# Altium schematic sheet Shuttler_AMC.SchDoc: =ProjectName
size 420 x 297 mm; Author: T.P.; CompanyName: WUT; DrawnBy: T.P.; Organization: WUT ISE; Address1: Warsaw Univeristy of Technology; Address2: Nowowiejska 15/19; DocumentNumber: 1; Revision: 0.9; SheetNumber: 1; SheetTotal: 36; EDA_Number: ARTIQ; Projet: ARTIQ/SINARA; ModifiedBy: -; CreateDate: XX/XX/XXXX; CheckedDate: -; Title2: Shuttler_AMC.SchDoc; DivGrp: ISE; Designer: G.K. and T.P.; ModifiedDate: -; ProjectName: ADC/DAC MEZZANINE
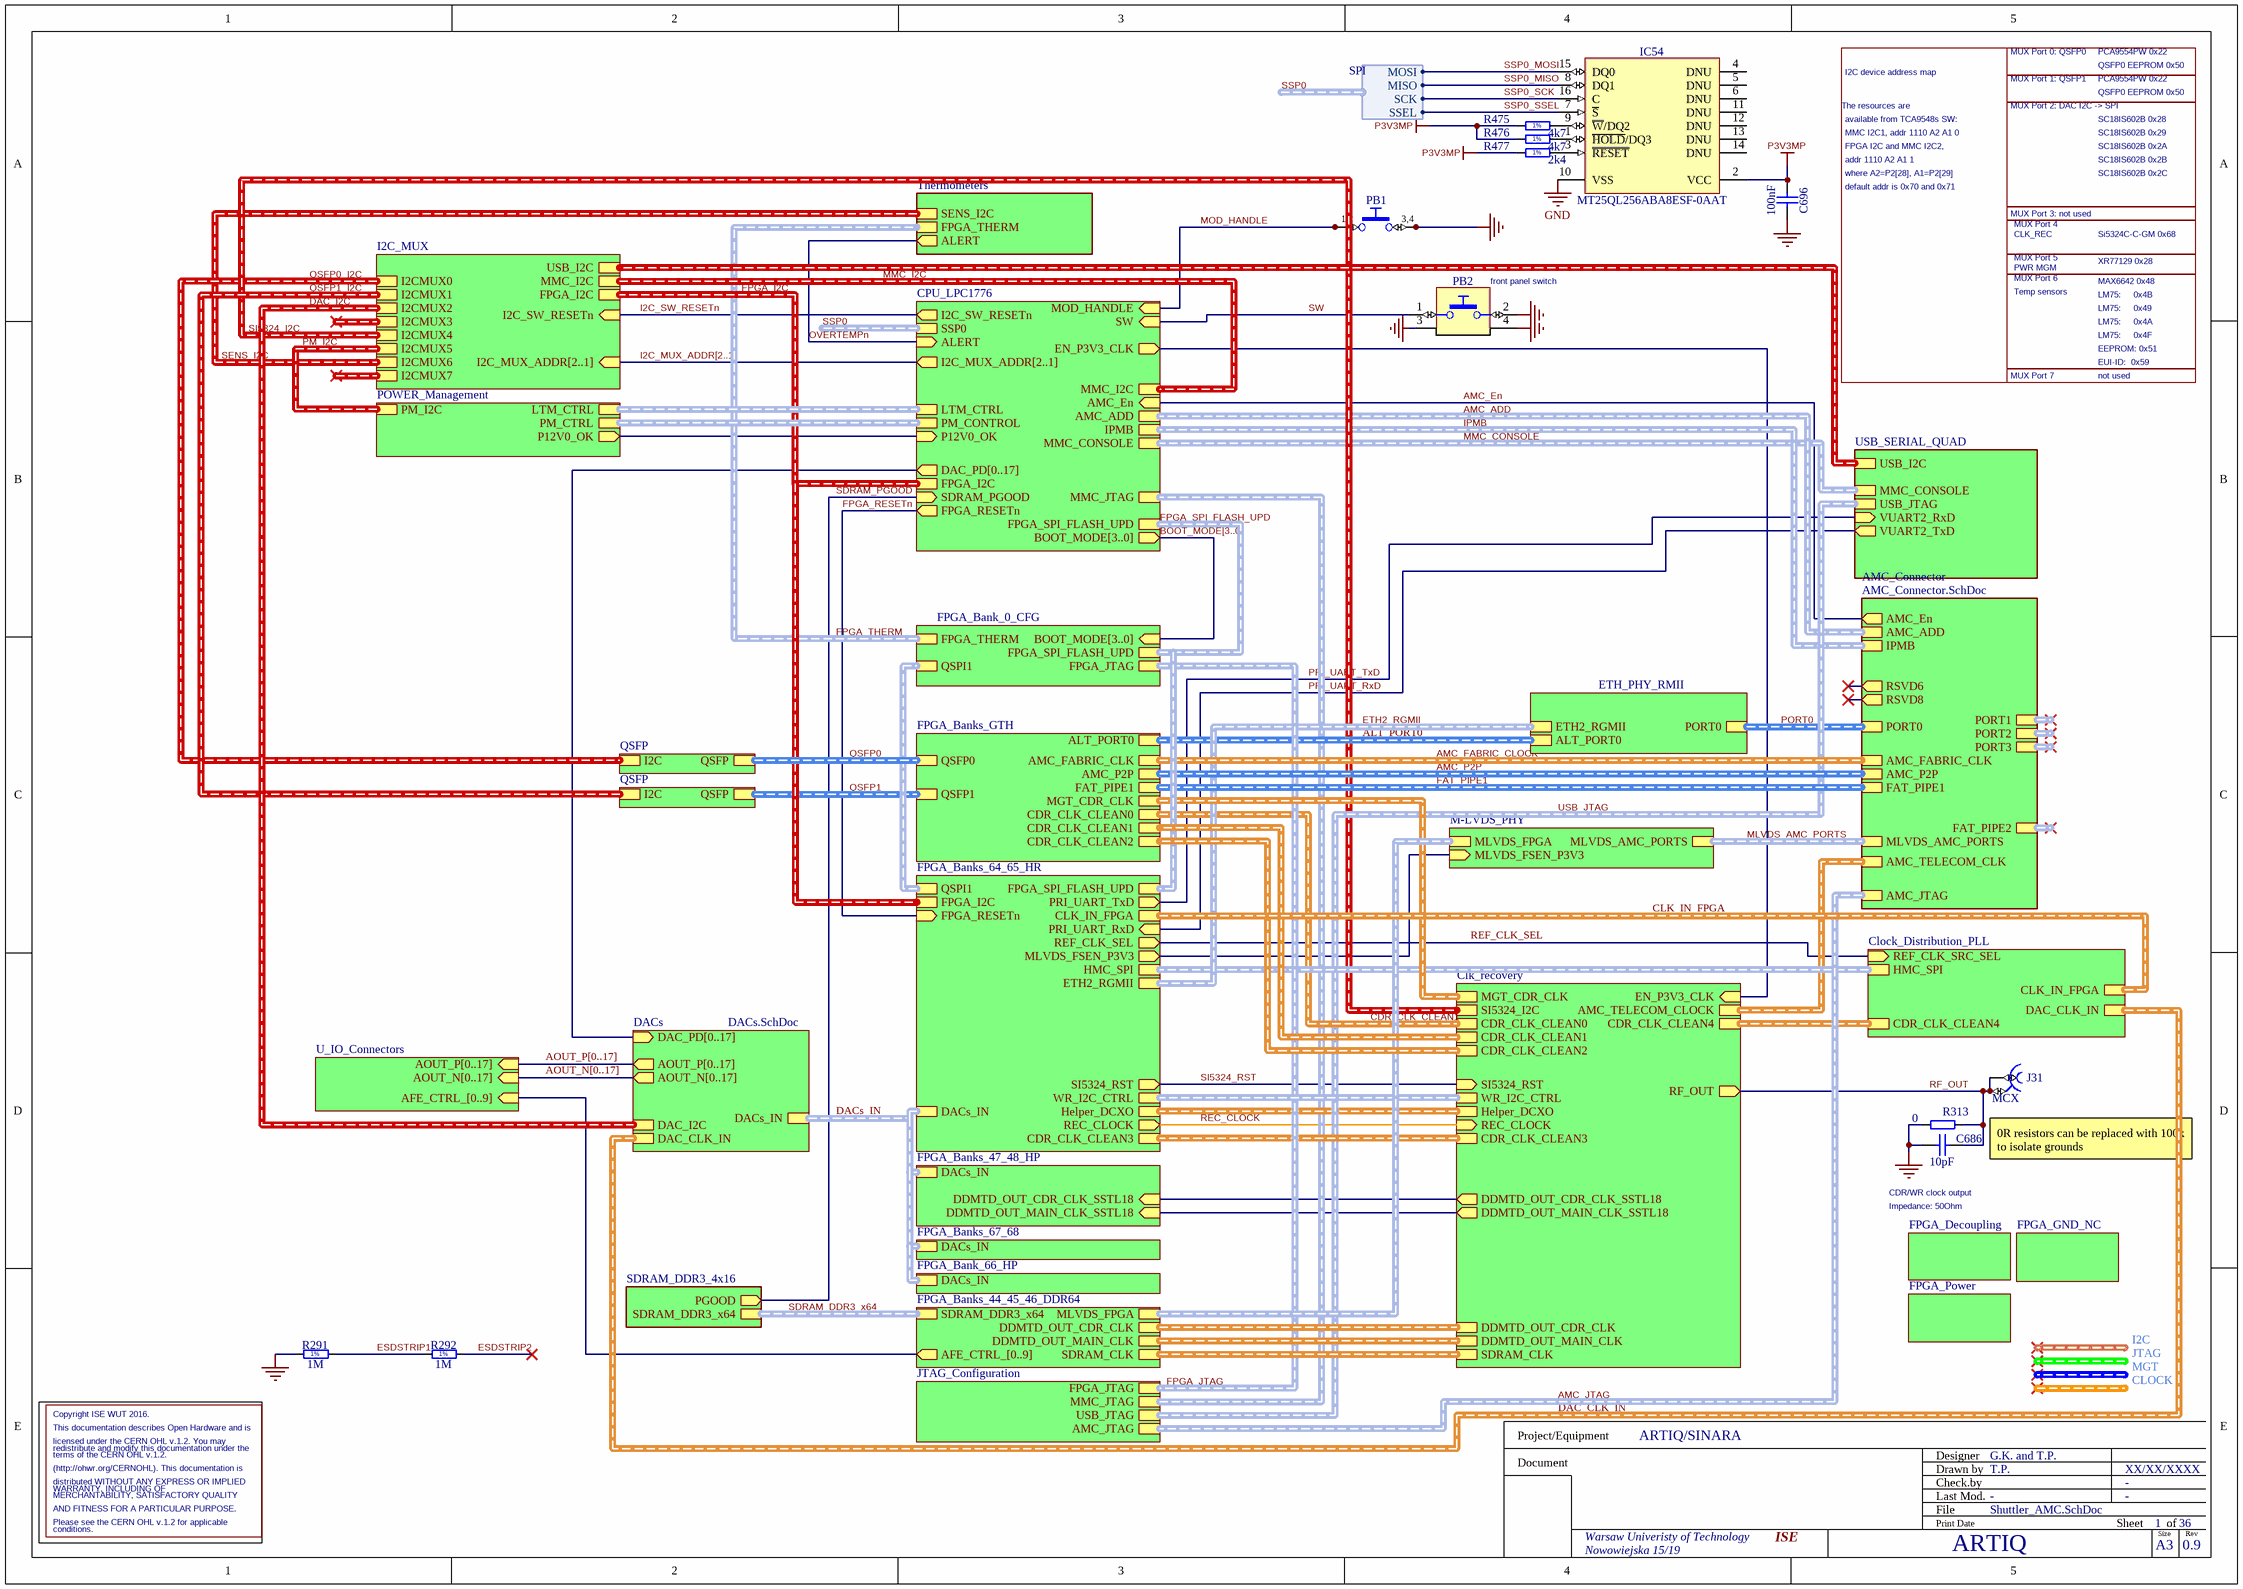
[diagram p0: Shuttler_AMC.SchDoc]

## Parts
C686  10pF  [CAPC1608X87N]
C696  100nF  [CAPC0603X33N]
IC54  MT25QL256ABA8ESF-0AAT  [SOIC127P1030X265-16N]
J31  MCX  [AMPHENOL_ARF2521-ND]
PB1  Push Button  [SW_C&K_HDT0001]  (value not drawn)
PB2  Push Button  [PB_ALPS_SKHHLQA010]  (value not drawn)
R291  1M  [RESC5025X65N]
R292  1M  [RESC5025X65N]
R313  0  [RESC1005X40N]
R475  4k7  [RESC1005X40N]
R476  4k7  [RESC1005X40N]
R477  2k4  [RESC1005X40N]

## Sub-sheets
AMC_Connector = AMC_Connector.SchDoc: AMC_ADD (harness AMC_GEOGRAPHIC_ADDRESS), IPMB (harness AMC_IPMB), AMC_En (out), PORT0 (harness PORT0), AMC_FABRIC_CLK (harness AMC_FABRIC_CLOCK), AMC_TELECOM_CLK (harness AMC_TELE), AMC_P2P (harness P2P), FAT_PIPE1 (harness FAT_PIPE1), FAT_PIPE2 (harness FAT_PIPE2), MLVDS_AMC_PORTS (harness MLVDS_AMC), AMC_JTAG (harness JTAG), PORT1 (harness PORT1), PORT3 (harness PORT3), RSVD8 (out), RSVD6 (out), PORT2 (harness PORT2)  | CmpIndex: 1; Name: AMC_CON74792; SHEETNAME: AMC_CON; SymIndex: 791
Clk_recovery = Clk_recovery.SchDoc: REC_CLOCK (in), SI5324_RST (in), CDR_CLK_CLEAN1 (harness CLK), CDR_CLK_CLEAN2 (harness CLK), SI5324_I2C (harness I2C), CDR_CLK_CLEAN3 (harness CLK), WR_I2C_CTRL (harness WR_I2C_CTRL), AMC_TELECOM_CLOCK (harness AMC_TELE), Helper_DCXO (harness CLK), RF_OUT (out), DDMTD_OUT_CDR_CLK (harness CLK), DDMTD_OUT_MAIN_CLK (harness CLK), DDMTD_OUT_CDR_CLK_SSTL18 (out), DDMTD_OUT_MAIN_CLK_SSTL18 (out), MGT_CDR_CLK (harness CLK), SDRAM_CLK (harness CLK), CDR_CLK_CLEAN0 (harness CLK), CDR_CLK_CLEAN4 (harness CLK), EN_P3V3_CLK (in)  | CmpIndex: 22; Name: Si5324 Clock recovery945991223; SymIndex: 1416
Clock_Distribution_PLL = Clock_Distribution_PLL.SchDoc: CDR_CLK_CLEAN4 (harness CLK), REF_CLK_SRC_SEL (in), CLK_IN_FPGA (harness CLK), DAC_CLK_IN (harness CLKs), HMC_SPI (harness SPI)
CPU_LPC1776 = CPU_LPC1776.SchDoc: ALERT (in), SW (in), MOD_HANDLE (in), FPGA_I2C (harness I2C), IPMB (harness AMC_IPMB), FPGA_SPI_FLASH_UPD (harness FLASH), FPGA_RESETn (out), SDRAM_PGOOD (in), MMC_CONSOLE (harness MMC_CONSOLE), AMC_ADD (harness AMC_GEOGRAPHIC_ADDRESS), MMC_I2C (harness I2C), AMC_En (in), PM_CONTROL (harness PM_CONTROL), SSP0 (harness SPI), I2C_SW_RESETn (out), I2C_MUX_ADDR[2..1] (out), P12V0_OK (in), BOOT_MODE[3..0] (out), MMC_JTAG (harness JTAG), DAC_PD[0..17] (out), EN_P3V3_CLK (out), LTM_CTRL (harness LTM_CTRL)  | CmpIndex: 54; Name: LPC17762984; SymIndex: 1756
DACs = DACs.SchDoc: DACs_IN (harness DAC_IN), DAC_I2C (harness I2C), DAC_CLK_IN (harness CLKs), AOUT_N[0..17] (out), AOUT_P[0..17] (out), DAC_PD[0..17] (in)
ETH_PHY_RMII = ETH_PHY_RMII.SchDoc: PORT0 (harness PORT0), ALT_PORT0 (harness PORT0), ETH2_RGMII (harness RGMII)
FPGA_Bank_0_CFG = FPGA_Bank_0_CFG.SchDoc: FPGA_SPI_FLASH_UPD (harness FLASH), FPGA_THERM (harness FPGA_THERM), BOOT_MODE[3..0] (in), FPGA_JTAG (harness JTAG), QSPI1
FPGA_Bank_66_HP = FPGA_Bank_66_HP.SchDoc: DACs_IN (harness DAC_IN)
FPGA_Banks_44_45_46_DDR64 = FPGA_Banks_44_45_46_DDR64.SchDoc: SDRAM_DDR3_x64 (harness SDRAM_64), MLVDS_FPGA (harness MLVDS_FPGA), AFE_CTRL_[0..9] (out), DDMTD_OUT_MAIN_CLK (harness CLK), DDMTD_OUT_CDR_CLK (harness CLK), SDRAM_CLK (harness CLK)
FPGA_Banks_47_48_HP = FPGA_Banks_47_48_HP.SchDoc: DACs_IN (harness DAC_IN), DDMTD_OUT_CDR_CLK_SSTL18 (in), DDMTD_OUT_MAIN_CLK_SSTL18 (in)
FPGA_Banks_64_65_HR = FPGA_Banks_64_65_HR.SchDoc: PRI_UART_TxD (out), FPGA_I2C (harness I2C), FPGA_RESETn (in), PRI_UART_RxD (in), SI5324_RST (out), FPGA_SPI_FLASH_UPD (harness FLASH), REF_CLK_SEL (out), CDR_CLK_CLEAN3 (harness CLK), REC_CLOCK (out), CLK_IN_FPGA (harness CLK), MLVDS_FSEN_P3V3 (out), QSPI1 (harness QSPI), WR_I2C_CTRL (harness WR_I2C_CTRL), HMC_SPI (harness SPI), Helper_DCXO (harness CLK), ETH2_RGMII (harness RGMII), DACs_IN (harness DAC_IN)
FPGA_Banks_67_68 = FPGA_Banks_67_68.SchDoc: DACs_IN (harness DAC_IN)
FPGA_Banks_GTH = FPGA_Banks_GTH.SchDoc: AMC_FABRIC_CLK (harness AMC_FABRIC_CLOCK), FAT_PIPE1 (harness FAT_PIPE1), CDR_CLK_CLEAN0 (harness CLK), AMC_P2P (harness P2P), QSFP0 (harness QSFP), ALT_PORT0 (harness PORT0), QSFP1 (harness QSFP), MGT_CDR_CLK, CDR_CLK_CLEAN1, CDR_CLK_CLEAN2 (harness CLK)
FPGA_Decoupling = FPGA_Decoupling.SchDoc: no entries
FPGA_GND_NC = FPGA_GND_NC.SchDoc: no entries
FPGA_Power = FPGA_Power.SchDoc: no entries
I2C_MUX = I2C_MUX.SchDoc: FPGA_I2C (harness I2C), MMC_I2C (harness I2C), I2CMUX7 (harness I2C), I2CMUX6 (harness I2C), I2CMUX5 (harness I2C), I2CMUX3 (harness I2C), I2CMUX2 (harness I2C), I2CMUX1 (harness I2C), I2CMUX0 (harness I2C), I2C_SW_RESETn (in), I2CMUX4 (harness I2C), I2C_MUX_ADDR[2..1] (in), USB_I2C  | CmpIndex: 23; Name: I2C_MUX; SymIndex: 1875
JTAG_Configuration = JTAG_Configuration.SchDoc: AMC_JTAG (harness JTAG), FPGA_JTAG (harness JTAG), USB_JTAG (harness JTAG_USB), MMC_JTAG (harness JTAG)  | CmpIndex: 3; Name: JTAG_CONF7; SHEETNAME: JTAG_CONF; SymIndex: 798
M-LVDS_PHY = M-LVDS_PHY.SchDoc: MLVDS_FPGA (harness MLVDS_FPGA), MLVDS_AMC_PORTS (harness MLVDS_AMC), MLVDS_FSEN_P3V3 (in)  | CmpIndex: 29; Name: AMC_FMC_Carrier_LVDS_PHY762107; SHEETNAME: LVDS_PHY; SymIndex: 800
POWER_Management = POWER_Management.SchDoc: PM_CTRL (harness PM_CONTROL), PM_I2C (harness I2C), P12V0_OK (out), LTM_CTRL (harness LTM_CTRL)  | CmpIndex: 13; Name: PWR_MGT75095; SHEETNAME: PWR_MGT; SymIndex: 796
QSFP = QSFP.SchDoc: I2C (harness I2C), QSFP (harness QSFP)
QSFP = QSFP.SchDoc: I2C (harness I2C), QSFP (harness QSFP)
SDRAM_DDR3_4x16 = SDRAM_DDR3_4x16.SchDoc: PGOOD (out), SDRAM_DDR3_x64 (harness SDRAM_64)  | CmpIndex: 2; SymIndex: 276
Thermometers = Thermometers.SchDoc: ALERT (out), FPGA_THERM (harness FPGA_THERM), SENS_I2C (harness I2C)  | CmpIndex: 44; Name: FMC_HPC2_THERMO; SHEETNAME: THERMO; SymIndex: 789
U_IO_Connectors = IO_Connectors.SchDoc: AOUT_P[0..17] (in), AOUT_N[0..17] (in), AFE_CTRL_[0..9] (in)
USB_SERIAL_QUAD = USB_SERIAL_QUAD.SchDoc: MMC_CONSOLE (harness MMC_CONSOLE), USB_JTAG (harness JTAG_USB), VUART2_TxD (out), VUART2_RxD (in), USB_I2C (harness I2C)  | CmpIndex: 0; Name: USB_UART_QUAD856120; SymIndex: 807

## Harnesses
SPI: SCK, SSEL, MISO, MOSI

## Nets
GND: C686.1 C696.1 IC54.10(VSS) PB1.3 PB1.4 PB2.2 PB2.3 PB2.4 R291.1 R313.2
P3V3MP: C696.2 IC54.2(VCC) R475.1 R476.1 R477.1
AMC_En: sheet AMC_Connector/AMC_En, sheet CPU_LPC1776/AMC_En
ESDSTRIP1: R291.2 R292.1
ESDSTRIP2: R292.2
FPGA_RESETn: sheet CPU_LPC1776/FPGA_RESETn, sheet FPGA_Banks_64_65_HR/FPGA_RESETn
I2C_SW_RESETn: sheet I2C_MUX/I2C_SW_RESETn, sheet CPU_LPC1776/I2C_SW_RESETn
MOD_HANDLE: PB1.1 PB1.2 ; sheet CPU_LPC1776/MOD_HANDLE
OVERTEMPn: sheet Thermometers/ALERT, sheet CPU_LPC1776/ALERT
PRI_UART_RxD: sheet USB_SERIAL_QUAD/VUART2_TxD, sheet FPGA_Banks_64_65_HR/PRI_UART_RxD
PRI_UART_TxD: sheet USB_SERIAL_QUAD/VUART2_RxD, sheet FPGA_Banks_64_65_HR/PRI_UART_TxD
REC_CLOCK: sheet Clk_recovery/REC_CLOCK, sheet FPGA_Banks_64_65_HR/REC_CLOCK
REF_CLK_SEL: sheet Clock_Distribution_PLL/REF_CLK_SRC_SEL, sheet FPGA_Banks_64_65_HR/REF_CLK_SEL
RF_OUT: C686.2 J31.1 J31.2 R313.1 ; sheet Clk_recovery/RF_OUT
SDRAM_PGOOD: sheet SDRAM_DDR3_4x16/PGOOD, sheet CPU_LPC1776/SDRAM_PGOOD
SI5324_RST: sheet Clk_recovery/SI5324_RST, sheet FPGA_Banks_64_65_HR/SI5324_RST
SSP0_MISO: IC54.8(DQ1) ; sheet CPU_LPC1776/SSP0.MISO  [project net SSP0.MISO]
SSP0_MOSI: IC54.15(DQ0) ; sheet CPU_LPC1776/SSP0.MOSI  [project net SSP0.MOSI]
SSP0_SCK: IC54.16(C) ; sheet CPU_LPC1776/SSP0.SCK  [project net SSP0.SCK]
SSP0_SSEL: IC54.7(~{S}) ; sheet CPU_LPC1776/SSP0.SSEL  [project net SSP0.SSEL]
SW: PB2.1 ; sheet CPU_LPC1776/SW
NetIC54_1: IC54.1(~{HOLD}/DQ3) R476.2
NetIC54_3: IC54.3(~{RESET}) R477.2
NetIC54_9: IC54.9(~{W}/DQ2) R475.2
(unnamed): sheet POWER_Management/P12V0_OK, sheet CPU_LPC1776/P12V0_OK
(unnamed): sheet Clk_recovery/DDMTD_OUT_CDR_CLK_SSTL18, sheet FPGA_Banks_47_48_HP/DDMTD_OUT_CDR_CLK_SSTL18
(unnamed): sheet Clk_recovery/DDMTD_OUT_MAIN_CLK_SSTL18, sheet FPGA_Banks_47_48_HP/DDMTD_OUT_MAIN_CLK_SSTL18
(unnamed): sheet Clk_recovery/EN_P3V3_CLK, sheet CPU_LPC1776/EN_P3V3_CLK
(unnamed): sheet M-LVDS_PHY/MLVDS_FSEN_P3V3, sheet FPGA_Banks_64_65_HR/MLVDS_FSEN_P3V3

Not connected (* = marked no-connect by the designer): IC54 4(DNU) 5(DNU) 6(DNU) 11(DNU) 12(DNU) 13(DNU) 14(DNU)

## Buses and harness runs
bus AOUT_N[0..17] = sheet DACs/AOUT_N[0..17] = sheet U_IO_Connectors/AOUT_N[0..17]
bus AOUT_P[0..17] = sheet DACs/AOUT_P[0..17] = sheet U_IO_Connectors/AOUT_P[0..17]
bus BOOT_MODE[3..0] = sheet CPU_LPC1776/BOOT_MODE[3..0] = sheet FPGA_Bank_0_CFG/BOOT_MODE[3..0]
bus I2C_MUX_ADDR[2..1] = sheet CPU_LPC1776/I2C_MUX_ADDR[2..1] = sheet I2C_MUX/I2C_MUX_ADDR[2..1]
bus sheet CPU_LPC1776/DAC_PD[0..17] = sheet DACs/DAC_PD[0..17]
bus sheet FPGA_Banks_44_45_46_DDR64/AFE_CTRL_[0..9] = sheet U_IO_Connectors/AFE_CTRL_[0..9]
harness ALT_PORT0 = sheet ETH_PHY_RMII/ALT_PORT0 = sheet FPGA_Banks_GTH/ALT_PORT0
harness AMC_ADD = sheet AMC_Connector/AMC_ADD = sheet CPU_LPC1776/AMC_ADD
harness AMC_FABRIC_CLOCK = sheet AMC_Connector/AMC_FABRIC_CLK = sheet FPGA_Banks_GTH/AMC_FABRIC_CLK
harness AMC_JTAG = sheet AMC_Connector/AMC_JTAG = sheet JTAG_Configuration/AMC_JTAG
harness AMC_P2P = sheet AMC_Connector/AMC_P2P = sheet FPGA_Banks_GTH/AMC_P2P
harness CDR_CLK_CLEAN1 = sheet Clk_recovery/CDR_CLK_CLEAN0 = sheet FPGA_Banks_GTH/CDR_CLK_CLEAN0
harness CLK_IN_FPGA = sheet Clock_Distribution_PLL/CLK_IN_FPGA = sheet FPGA_Banks_64_65_HR/CLK_IN_FPGA
harness DAC_CLK_IN = sheet Clock_Distribution_PLL/DAC_CLK_IN = sheet DACs/DAC_CLK_IN
harness DAC_I2C = sheet DACs/DAC_I2C = sheet I2C_MUX/I2CMUX2
harness DACs_IN = sheet DACs/DACs_IN = sheet FPGA_Bank_66_HP/DACs_IN = sheet FPGA_Banks_47_48_HP/DACs_IN = sheet FPGA_Banks_64_65_HR/DACs_IN = sheet FPGA_Banks_67_68/DACs_IN
harness ETH2_RGMII = sheet ETH_PHY_RMII/ETH2_RGMII = sheet FPGA_Banks_64_65_HR/ETH2_RGMII
harness FAT_PIPE1 = sheet AMC_Connector/FAT_PIPE1 = sheet FPGA_Banks_GTH/FAT_PIPE1
harness FPGA_I2C = sheet CPU_LPC1776/FPGA_I2C = sheet FPGA_Banks_64_65_HR/FPGA_I2C = sheet I2C_MUX/FPGA_I2C
harness FPGA_JTAG = sheet FPGA_Bank_0_CFG/FPGA_JTAG = sheet JTAG_Configuration/FPGA_JTAG
harness FPGA_SPI_FLASH_UPD = sheet CPU_LPC1776/FPGA_SPI_FLASH_UPD = sheet FPGA_Bank_0_CFG/FPGA_SPI_FLASH_UPD = sheet FPGA_Banks_64_65_HR/FPGA_SPI_FLASH_UPD
harness FPGA_THERM = sheet FPGA_Bank_0_CFG/FPGA_THERM = sheet Thermometers/FPGA_THERM
harness IPMB = sheet AMC_Connector/IPMB = sheet CPU_LPC1776/IPMB
harness MLVDS_AMC_PORTS = sheet AMC_Connector/MLVDS_AMC_PORTS = sheet M-LVDS_PHY/MLVDS_AMC_PORTS
harness MMC_CONSOLE = sheet CPU_LPC1776/MMC_CONSOLE = sheet USB_SERIAL_QUAD/MMC_CONSOLE
harness MMC_I2C = sheet CPU_LPC1776/MMC_I2C = sheet I2C_MUX/MMC_I2C
harness PM_I2C = sheet I2C_MUX/I2CMUX5 = sheet POWER_Management/PM_I2C
harness PORT0 = sheet AMC_Connector/PORT0 = sheet ETH_PHY_RMII/PORT0
harness QSFP0 = sheet FPGA_Banks_GTH/QSFP0 = sheet QSFP/QSFP
harness QSFP0_I2C = sheet I2C_MUX/I2CMUX0 = sheet QSFP/I2C
harness QSFP1 = sheet FPGA_Banks_GTH/QSFP1 = sheet QSFP/QSFP
harness QSFP1_I2C = sheet I2C_MUX/I2CMUX1 = sheet QSFP/I2C
harness SDRAM_DDR3_x64 = sheet FPGA_Banks_44_45_46_DDR64/SDRAM_DDR3_x64 = sheet SDRAM_DDR3_4x16/SDRAM_DDR3_x64
harness SENS_I2C = sheet I2C_MUX/I2CMUX6 = sheet Thermometers/SENS_I2C
harness sheet AMC_Connector/AMC_TELECOM_CLK = sheet Clk_recovery/AMC_TELECOM_CLOCK
harness sheet Clk_recovery/CDR_CLK_CLEAN1 = sheet FPGA_Banks_GTH/CDR_CLK_CLEAN1
harness sheet Clk_recovery/CDR_CLK_CLEAN2 = sheet FPGA_Banks_GTH/CDR_CLK_CLEAN2
harness sheet Clk_recovery/CDR_CLK_CLEAN3 = sheet FPGA_Banks_64_65_HR/CDR_CLK_CLEAN3
harness sheet Clk_recovery/CDR_CLK_CLEAN4 = sheet Clock_Distribution_PLL/CDR_CLK_CLEAN4
harness sheet Clk_recovery/DDMTD_OUT_CDR_CLK = sheet FPGA_Banks_44_45_46_DDR64/DDMTD_OUT_CDR_CLK
harness sheet Clk_recovery/DDMTD_OUT_MAIN_CLK = sheet FPGA_Banks_44_45_46_DDR64/DDMTD_OUT_MAIN_CLK
harness sheet Clk_recovery/Helper_DCXO = sheet FPGA_Banks_64_65_HR/Helper_DCXO
harness sheet Clk_recovery/MGT_CDR_CLK = sheet FPGA_Banks_GTH/MGT_CDR_CLK
harness sheet Clk_recovery/SDRAM_CLK = sheet FPGA_Banks_44_45_46_DDR64/SDRAM_CLK
harness sheet Clk_recovery/WR_I2C_CTRL = sheet FPGA_Banks_64_65_HR/WR_I2C_CTRL
harness sheet Clock_Distribution_PLL/HMC_SPI = sheet FPGA_Banks_64_65_HR/HMC_SPI
harness sheet CPU_LPC1776/LTM_CTRL = sheet POWER_Management/LTM_CTRL
harness sheet CPU_LPC1776/MMC_JTAG = sheet JTAG_Configuration/MMC_JTAG
harness sheet CPU_LPC1776/PM_CONTROL = sheet POWER_Management/PM_CTRL
harness sheet FPGA_Bank_0_CFG/QSPI1 = sheet FPGA_Banks_64_65_HR/QSPI1
harness sheet FPGA_Banks_44_45_46_DDR64/MLVDS_FPGA = sheet M-LVDS_PHY/MLVDS_FPGA
harness sheet I2C_MUX/USB_I2C = sheet USB_SERIAL_QUAD/USB_I2C
harness SI5324_I2C = sheet Clk_recovery/SI5324_I2C = sheet I2C_MUX/I2CMUX4
harness SSP0 = sheet CPU_LPC1776/SSP0
harness USB_JTAG = sheet JTAG_Configuration/USB_JTAG = sheet USB_SERIAL_QUAD/USB_JTAG

## Notes on the sheet
- MUX Port 0: QSFP0
- PCA9554PW 0x22
- The resources are
- I2C device address map
- available from TCA9548s SW:
- MUX Port 1: QSFP1
- MUX Port 2: DAC I2C -> SPI
- SC18IS602B 0x28
- QSFP0 EEPROM 0x50
- FPGA I2C and MMC I2C2,
- MMC I2C1, addr 1110 A2 A1 0
- addr 1110 A2 A1 1
- where A2=P2[28], A1=P2[29]
- default addr is 0x70 and 0x71
- SC18IS602B 0x29
- SC18IS602B 0x2A
- SC18IS602B 0x2B
- SC18IS602B 0x2C
- MUX Port 3: not used
- MUX Port 4
- MUX Port 5
- CLK_REC
- XR77129 0x28
- Si5324C-C-GM 0x68
- (near PB2) front panel switch
- MUX Port 6
- Temp sensors
- PWR MGM
- MAX6642 0x48
- LM75:     0x49
- LM75:     0x4B
- LM75:     0x4A
- MUX Port 7
- EUI-ID:  0x59
- LM75:     0x4F
- not used
- EEPROM: 0x51
- CDR/WR clock output
- Impedance: 50Ohm
- 0R resistors can be replaced with 100k to isolate grounds
- I2C
- Copyright ISE WUT 2016.
- JTAG
- MGT
- CLOCK
- terms of the CERN OHL v.1.2.
- WARRANTY, INCLUDING OF
- (http://ohwr.org/CERNOHL). This documentation is
- This documentation describes Open Hardware and is
- distributed WITHOUT ANY EXPRESS OR IMPLIED
- licensed under the CERN OHL v.1.2. You may
- redistribute and modify this documentation under the
- Please see the CERN OHL v.1.2 for applicable
- AND FITNESS FOR A PARTICULAR PURPOSE.
- MERCHANTABILITY, SATISFACTORY QUALITY
- conditions.
- Project/Equipment
- Document
- Designer
- Drawn by
- Check.by
- File
- Last Mod.
- Print Date
- Sheet
- Size
- A3
- of
- Rev
- (in symbol R0402_2K4_1%_0.0625W_100PPM) 1%
- (in symbol R0402_4K7_1%_0.0625W_100PPM) 1%
- (in symbol R2010_1M_1%_0.5W_200PPM) 1%
- (in symbol SW_C&K_HDT0001) 1,2; 3,4

## Library data of the parts
C686 = CC0603_10PF_50V_5%_NP0: Non-polarised capacitor; Manufacturer: GENERIC; Part Description: SMD Multilayer Chip Ceramic Capacitor; Manufacturer1 Part Number: 223886715109; Tolerance: ±5%; Voltage: 50V; TC: C0G/NP0; Manufacturer Part Number: CC0603_10PF_50V_5%_NP0; Part Number: CC0603_10PF_50V_5%_NP0; Value: 10pF; Component Kind: Standard; Component Type: Standard; Pin Count: 2; Status: Preferred; Case: 0603; Mounted: Yes; Socket: No; SMD: Yes; Sense: No; Manufacturer1 Example: PHYCOMP; Manufacturer1 ComponentHeight: 0.87mm; HelpURL: \\cern.ch\dfs\Applications\Altium\Datasheets\CC0603_NP0_PHYCOMP.pdf; Author: CERN DEM JLC; CreateDate: 03.12.2007; LatestRevisionDate: 03.12.2007
C696 = CC0201_100NF_6.3V_10%_X5R: Non-polarised capacitor; Manufacturer: GENERIC; Part Description: SMD Multilayer Chip Ceramic Capacitor; Manufacturer1 Part Number: 02016D104KAT2A; Tolerance: ±10%; Voltage: 6.3V; TC: X5R; Manufacturer Part Number: CC0201_100NF_6.3V_10%_X5R; Part Number: CC0201_100NF_6.3V_10%_X5R; Value: 100nF; Component Kind: Standard; Component Type: Standard; Pin Count: 2; Status: Not Recommended; Case: 0201; Mounted: Yes; Socket: No; SMD: Yes; Sense: No; Manufacturer1 Example: AVX; Manufacturer1 ComponentHeight: 0.33mm; HelpURL: \\cern.ch\dfs\Applications\Altium\Datasheets\CC0201_X5R_AVX.pdf; Author: CERN DEM JLC; CreateDate: 03.12.2007; LatestRevisionDate: 03.12.2007
IC54 = MT25QL256ABA8ESF-0AAT: 256Mbit (32MB), 2.7V-3.6V, Multiple I/O Serial NOR Flash Memory,with Reset# & Hold#; Part Description: 256Mbit (32MB), 2.7V-3.6V, Multiple I/O Serial NOR Flash Memory,with Reset# & Hold# (Automotive grade AEC-Q100); Manufacturer: MICRON TECHNOLOGY; PressFit: No; Bonding: No; Part Number: MT25QL256ABA8ESF-0AAT; Component Kind: Standard; Component Type: Standard; Device: MT25QL256ABA8ESF-0AAT; PackageDescription: SOIC 16, Pitch 1.27mm - Body 7.5x10.3mm, IPC Medium Density; Manufacturer Part Number: MT25QL256ABA8ESF-0AAT; Pin Count: 16; Case: SOIC16; Mounted: Yes; Socket: No; SMD: Yes; Sense: No; ComponentHeight: 2.65mm; HelpURL: \\cern.ch\dfs\Applications\Altium\Datasheets\MT25QL256ABA8ESF-0AAT.pdf; Author: CERN DEM JLC; CreateDate: 05.11.2018; LatestRevisionDate: 05.11.2018
J31 = CON_MCX: Part Description: 50 Ohms MCX Right Angle PCB Receptacle (Jack); Manufacturer: AMPHENOL; PressFit: No; Part Number: AMPHENOL_ARF2521-ND; Component Kind: Standard; Component Type: Standard; Pin Count: 2; Family: MCX; Mounted: Yes; Socket: No; SMD: No; Sense: No; Status: None; Manufacturer Part Number: AMPHENOL_ARF2521-ND; ComponentHeight: 6; HelpURL: \\cern.ch\dfs\Applications\Altium\Datasheets\AMPHENOL_34-1030-12G.pdf; Author: GK; CreateDate: 21.02.2017; LatestRevisionDate: 21.02.2017
PB1 = SW_C&K_HDT0001: Push-Button Switch SPDT; Manufacturer: C&K; Part Description: 5VDC 1mA SPST-NO Micro Mini Surface Surface Mount Detect Push-Button Switch, HDT Series; PressFit: No; Manufacturer Part Number: HDT0001; PackageDescription: Body 3.5x2.8mm, Micro Mini Surface Mount Detect Switches, HDT Serie; Part Number: SW_C&K_HDT0001; Component Kind: Standard; Component Type: Standard; Pin Count: 4; Family: Push Button; Mounted: Yes; Socket: No; SMD: Yes; Sense: No; Status: None; ComponentHeight: 3.35mm; HelpURL: \\cern.ch\dfs\Applications\Altium\Datasheets\SW_C&K_HDT0001.pdf; Author: CERN DEM JLC; CreateDate: 15.08.2012; LatestRevisionDate: 15.08.2012
PB2 = PB_ALPS_SKHHLQA010: Push-Button Switch SPDT; Manufacturer: ALPS; Part Description: 6x6mm, SPST Horizontal Pushbutton Switch, Stem height 8.35mm, Contact Rating 50mA 12VDC, SKHH Series; PressFit: No; Sense Comment: Non-washable; Manufacturer Part Number: SKHHLQA010; PackageDescription: Body 6x6mm, Stem height 8.35mm, Horizontal Pushbutton Switch, ALPS Serie SKHH; Part Number: PB_ALPS_SKHHLQA010; Component Kind: Standard; Component Type: Standard; Pin Count: 4; Family: Push Button; Mounted: Yes; Socket: No; SMD: No; Sense: Yes; Status: None; ComponentHeight: 7.4mm; HelpURL: \\cern.ch\dfs\Applications\Altium\Datasheets\PB_ALPS_SKHHLQA010.pdf; Author: CERN DEM JLC; CreateDate: 15.01.2009; LatestRevisionDate: 15.01.2009
R291 R292 = R2010_1M_1%_0.5W_200PPM: Resistor - 1%; Manufacturer: GENERIC; Part Description: Thick Film Chip Resistor; Manufacturer1 Part Number: LHVC2010-1MFT4; Power: 0.5W; TC: ±200ppm/°C; PressFit: No; Manufacturer Part Number: R2010_1M_1%_0.5W_200PPM; Part Number: R2010_1M_1%_0.5W_200PPM; Tolerance: ±1%; Value: 1M; Component Kind: Standard; Component Type: Standard; Pin Count: 2; Status: None; Case: 2010; Mounted: Yes; Sense: No; Socket: No; SMD: Yes; Manufacturer1 Example: TT WELWYN; Manufacturer1 ComponentHeight: 0.65mm; HelpURL: \\cern.ch\dfs\Applications\Altium\Datasheets\R2010_WELWYN_LHVC.pdf; Author: CERN DEM JLC; CreateDate: 26.02.2015; LatestRevisionDate: 26.02.2015
R313 = R0402_0R_JUMPER: Resistor; Manufacturer: GENERIC; Part Description: 1A (0.05R Max DC Resistance) Zero Ohm Jumper; Manufacturer1 Part Number: 232270591001L; PressFit: No; Manufacturer Part Number: R0402_0R_JUMPER; Part Number: R0402_0R_JUMPER; Value: 0; Component Kind: Standard; Component Type: Standard; Pin Count: 2; Status: Not Recommended; Case: 0402; Mounted: Yes; Sense: No; Socket: No; SMD: Yes; Manufacturer1 Example: YAGEO PHYCOMP; Manufacturer1 ComponentHeight: 0.4mm; HelpURL: \\cern.ch\dfs\Applications\Altium\Datasheets\R0402_Phycomp_RC0402.pdf; Author: CERN DEM JLC; CreateDate: 03.12.2007; LatestRevisionDate: 17.10.2012
R475 R476 = R0402_4K7_1%_0.0625W_100PPM: Resistor - 1%; Manufacturer: GENERIC; Part Description: General Purpose Thick Film Chip Resistor; Manufacturer1 Part Number: 232270674702L; TC: ±100ppm/°C; PressFit: No; Manufacturer Part Number: R0402_4K7_1%_0.0625W_100PPM; Part Number: R0402_4K7_1%_0.0625W_100PPM; Tolerance: ±1%; Value: 4k7; Component Kind: Standard; Component Type: Standard; Pin Count: 2; Status: Not Recommended; Power: 0.0625W; Case: 0402; Mounted: Yes; Sense: No; Socket: No; SMD: Yes; Manufacturer1 Example: YAGEO PHYCOMP; Manufacturer1 ComponentHeight: 0.4mm; HelpURL: \\cern.ch\dfs\Applications\Altium\Datasheets\R0402_Phycomp_RC0402.pdf; Author: CERN DEM JLC; CreateDate: 03.12.2007; LatestRevisionDate: 17.10.2012
R477 = R0402_2K4_1%_0.0625W_100PPM: Resistor - 1%; Part Description: General Purpose Thick Film Chip Resistor; Manufacturer: GENERIC; Manufacturer1 Part Number: 232270672402L; TC: ±100ppm/°C; PressFit: No; Part Number: R0402_2K4_1%_0.0625W_100PPM; Component Kind: Standard; Component Type: Standard; Pin Count: 2; Value: 2k4; Status: Not Recommended; Power: 0.0625W; Tolerance: ±1%; Manufacturer Part Number: R0402_2K4_1%_0.0625W_100PPM; Case: 0402; Mounted: Yes; Sense: No; Socket: No; SMD: Yes; Manufacturer1 Example: YAGEO PHYCOMP; Manufacturer1 ComponentHeight: 0.4mm; HelpURL: \\cern.ch\dfs\Applications\Altium\Datasheets\R0402_Phycomp_RC0402.pdf; Author: CERN DEM JLC; CreateDate: 03.12.2007; LatestRevisionDate: 17.10.2012